# EAGLE design rxsms-2.0-Stromvers (EAGLE 6.6.0)

## Sheet 1 of 2
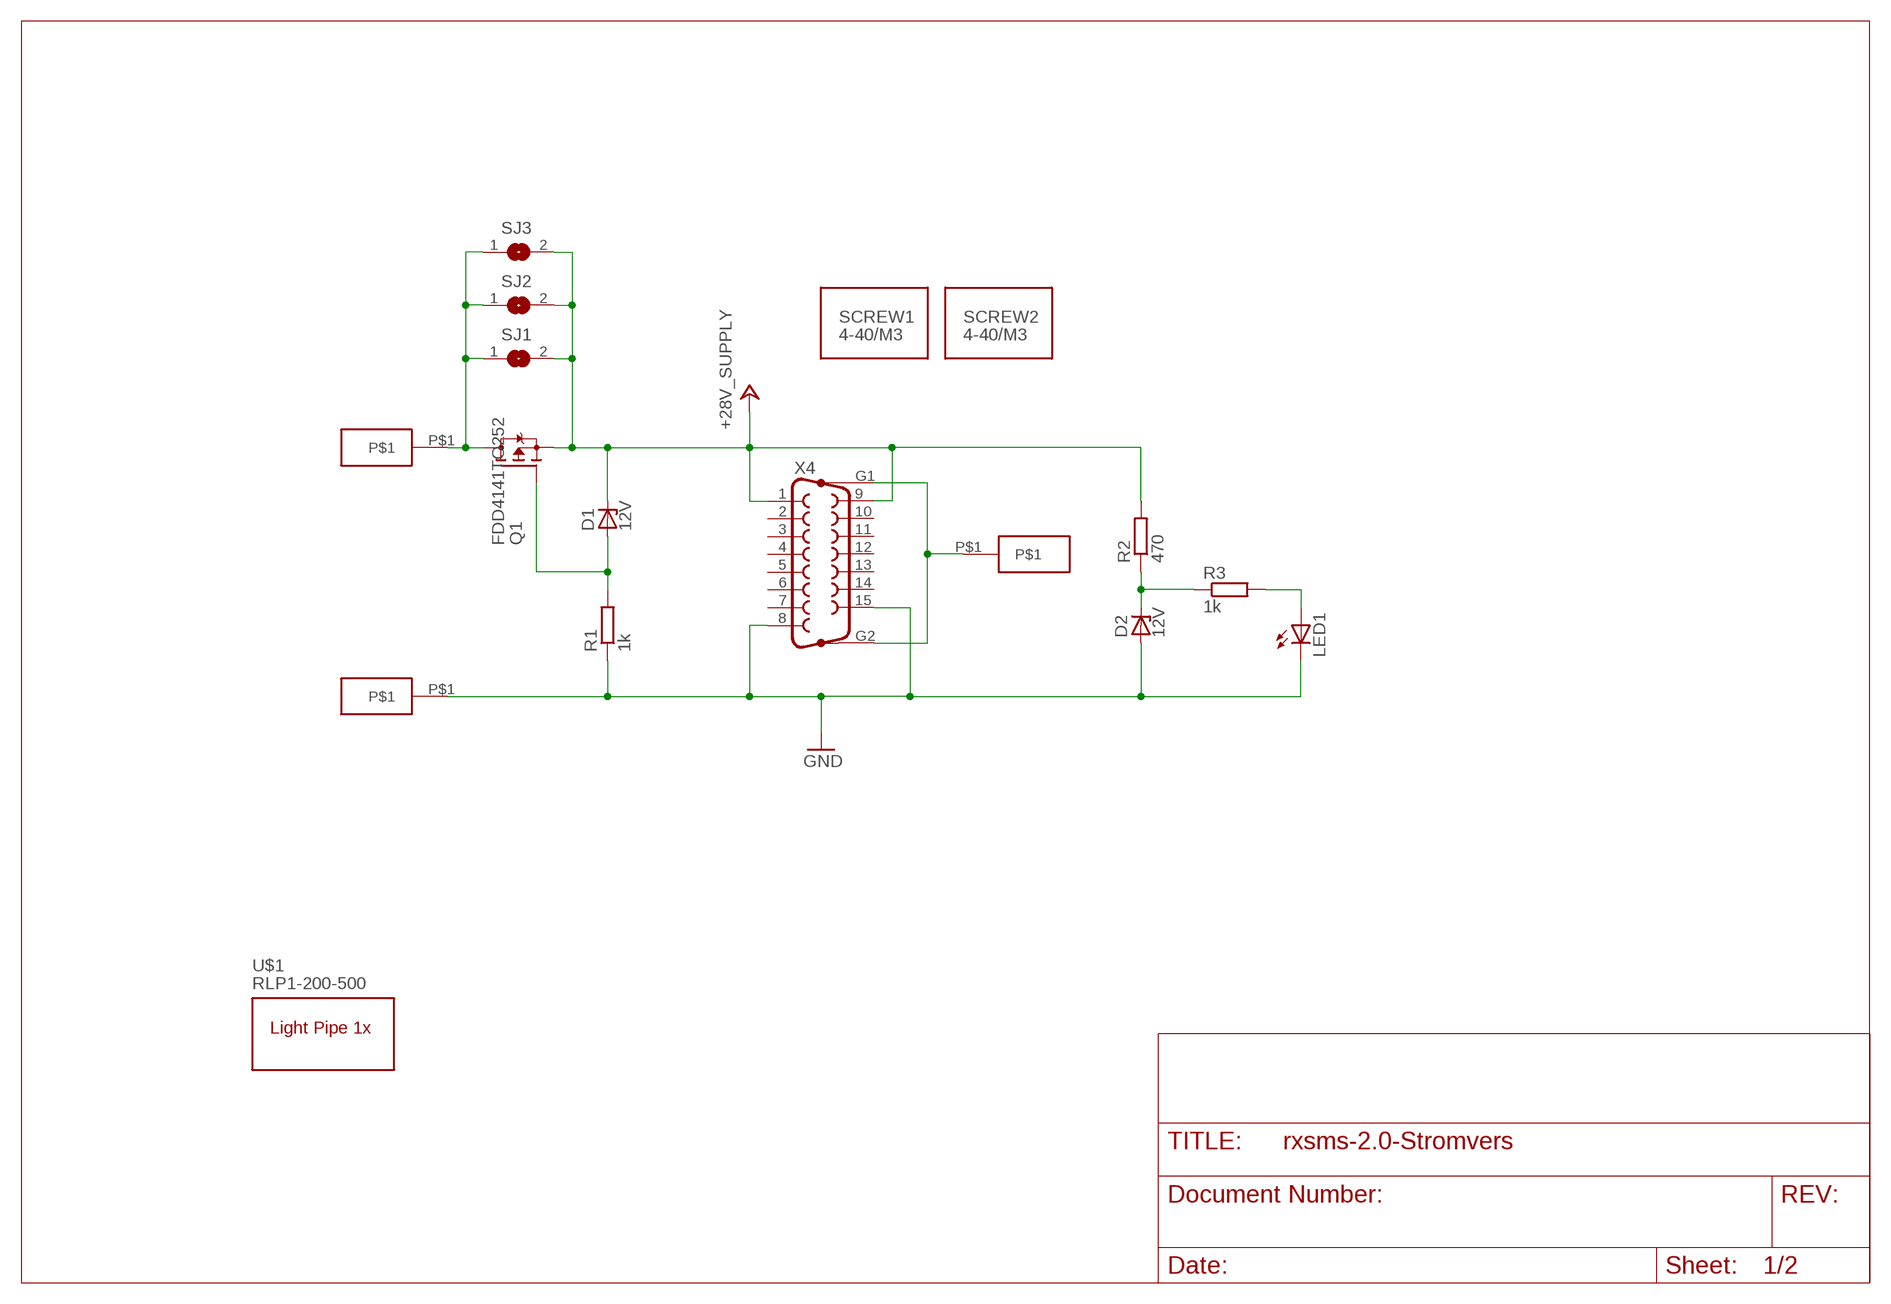
[diagram p0: schematic, sheet 1]

### Parts
D1  12V  ZENER-DIODEDO34-7  [DO34Z7]
D2  12V  ZENER-DIODEDO34-7  [DO34Z7]
LED1  LEDCHIPLED_0805  [CHIPLED_0805]
Q1  FDD4141TO252  [TO252]
R1  1k  R-EU_R0805  [R0805]
R2  470  R-EU_R0805  [R0805]
R3  1k  R-EU_R0805  [R0805]
SCREW1  4-40/M3  DSUB_MOUNTING_SCREW  [SCREW_DUMMY]
SCREW2  4-40/M3  DSUB_MOUNTING_SCREW  [SCREW_DUMMY]
SJ1  SJ  [SJ]
SJ2  SJ  [SJ]
SJ3  SJ  [SJ]
U$1  RLP1-200-500  [RLP1-200-500]
U$3  JACK  [JACK]
U$4  JACK  [JACK]
U$5  JACK  [JACK]
X4  F15HP  [F15HP]

### Nets
+28V_SUPPLY: D1.C Q1.2(S) R2.2 SJ1.2 SJ2.2 SJ3.2 X4.1 X4.9 ; also sheet 2
BLUB: Q1.3(D) SJ1.1 SJ2.1 SJ3.1 U$3.P$1
GND: D2.A LED1.C R1.1 U$4.P$1 X4.8 X4.15 ; also sheet 2
N$1: D2.C R2.1 R3.1
N$2: D1.A Q1.1(G) R1.2
N$3: LED1.A R3.2
PE: U$5.P$1 X4.G1 X4.G2
Unconnected: X4.2 X4.3 X4.4 X4.5 X4.6 X4.7 X4.10 X4.11 X4.12 X4.13 X4.14

## Sheet 2 of 2
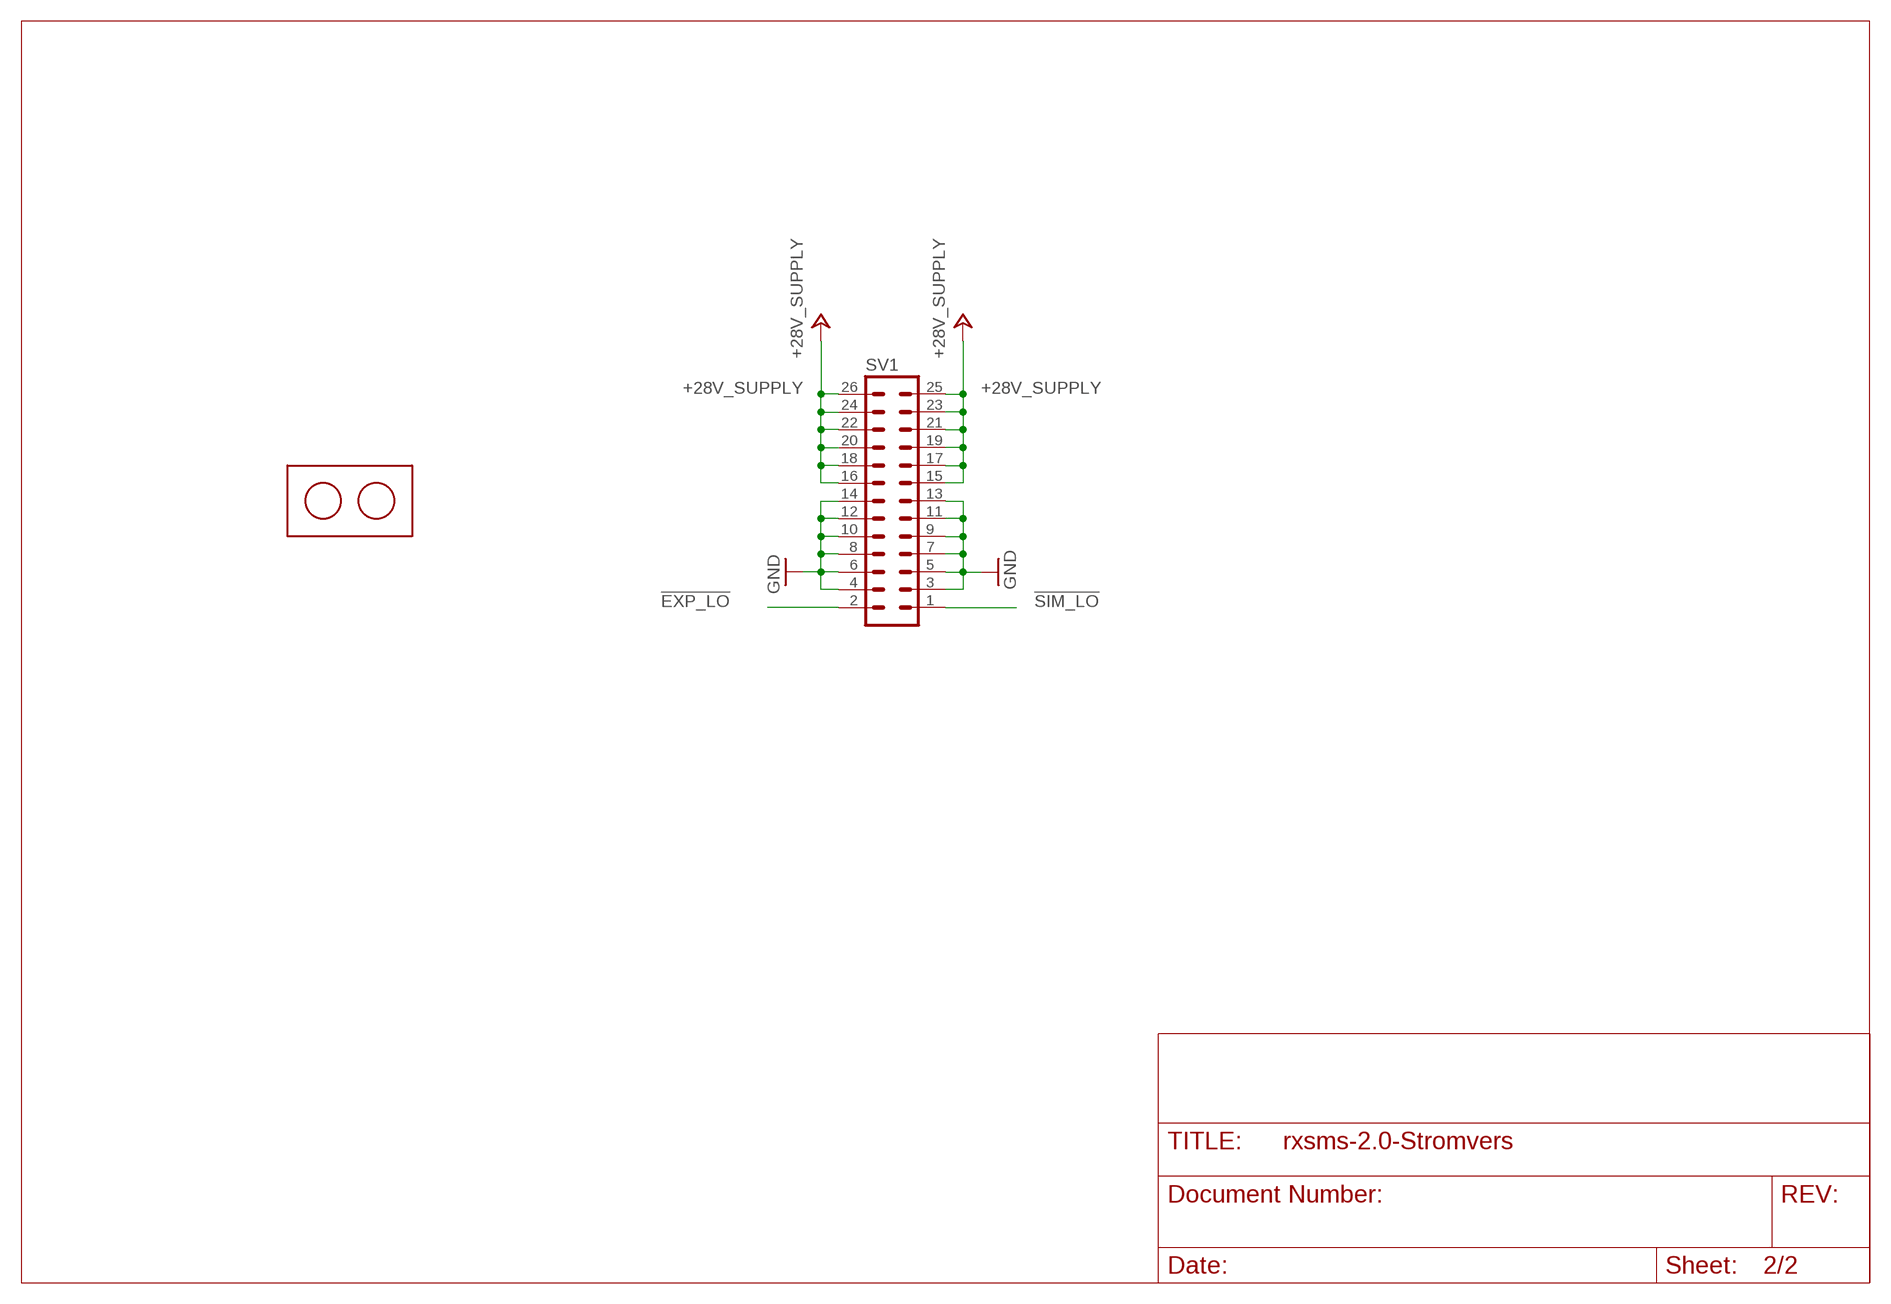
[diagram p1: schematic, sheet 2]

### Parts
SV1  ML26L  [ML26L]
U$6  BUERKLIN17H912  [BUERKLIN17H912]

### Nets
+28V_SUPPLY: SV1.15 SV1.16 SV1.17 SV1.18 SV1.19 SV1.20 SV1.21 SV1.22 SV1.23 SV1.24 SV1.25 SV1.26 ; also sheet 1
GND: SV1.3 SV1.4 SV1.5 SV1.6 SV1.7 SV1.8 SV1.9 SV1.10 SV1.11 SV1.12 SV1.13 SV1.14 ; also sheet 1
Unconnected: SV1.1 SV1.2

## Library data of the parts
D1 D2 = diode:ZENER-DIODE: Z-Diode; OC_FARNELL: 1779204
LED1 = led:LED: LED OSRAM: - CHIPLED LG R971, LG N971, LY N971, LG Q971, LY Q971, LO R971, LY R971 LH N974, LH R974 LS Q976, LO Q976, LY Q976 LO Q996 - Hyper CHIPLED LW Q18S LB Q993, LB Q99A, LB R99A - SideLED LS A670, LO A670, LY A670, LG A670, LP A670 LB A673, LV A673, LT A673, LW A673 LH A674 LY A675 LS A676, LA A676, LO A676, LY A676, LW A676 LS A679, LY A679, LG A679 - Hyper Micro SIDELED® LS Y876, LA Y876, LO Y876, LY Y876 LT Y87S - SmartLED LW L88C, LW L88S LB L89C, LB L89S, LG L890 LS L89K, LO L89K, LY L89K LS L896, LA L896, LO L896, LY L896 - TOPLED LS T670, LO T670, LY T670, LG T670, LP T670 LSG T670, LSP T670, LSY T670, LOP T670, LYG T670 LG T671, LOG T671, LSG T671 LB T673, LV T673, LT T673, LW T673 LH T674 LS T676, LA T676, LO T676, LY T676, LB T676, LH T676, LSB T676, LW T676 LB T67C, LV T67C, LT T67C, LS T67K, LO T67K, LY T67K, LW E67C LS E67B, LA E67B, LO E67B, LY E67B, LB E67C, LV E67C, LT E67C LW T67C LS T679, LY T679, LG T679 LS T770, LO T770, LY T770, LG T770, LP T770 LB T773, LV T773, LT T773, LW T773 LH T774 LS E675, LA E675, LY E675, LS T675 LS T776, LA T776, LO T776, LY T776, LB T776 LHGB T686 LT T68C, LB T68C - Hyper Mini TOPLED® LB M676 - Mini TOPLED Santana® LG M470 LS M47K, LO M47K, LY M47K Source: http://www.osram.convergy.de LUXEON: - LUMILED® LXK2-PW12-R00, LXK2-PW12-S00, LXK2-PW14-U00, LXK2-PW14-V00 LXK2-PM12-R00, LXK2-PM12-S00, LXK2-PM14-U00 LXK2-PE12-Q00, LXK2-PE12-R00, LXK2-PE12-S00, LXK2-PE14-T00, LXK2-PE14-U00 LXK2-PB12-K00, LXK2-PB12-L00, LXK2-PB12-M00, LXK2-PB14-N00, LXK2-PB14-P00, LXK2-PB14-Q00 LXK2-PR12-L00, LXK2-PR12-M00, LXK2-PR14-Q00, LXK2-PR14-R00 LXK2-PD12-Q00, LXK2-PD12-R00, LXK2-PD12-S00 LXK2-PH12-R00, LXK2-PH12-S00 LXK2-PL12-P00, LXK2-PL12-Q00, LXK2-PL12-R00 Source: www.luxeon.com KINGBRIGHT: KA-3528ASYC Source: www.kingbright.com; OC_RS: 692-0957
Q1 = transistor-fet:FDD4141: P-Channel PowerTrench® MOSFET Source: FDD4141.pdf; OC_FARNELL: 2101406
R1-R3 = rcl:R-EU_: RESISTOR, European symbol
SCREW1 SCREW2 = dsub-mounting-screw:DSUB_MOUNTING_SCREW; OC_FARNELL: 2135988
SJ1-SJ3 = jumper:SJ: SMD solder JUMPER
SV1 = con-harting-ml:ML26: HARTING; OC_FARNELL: 1096983 (Gegenstück: 1200506 oder 1097038); OC_NEWARK: unknown
U$1 = light-pipe:RLP1-200-500; OC_FARNELL: 1887972; OC_RS: 752-9141
U$3-U$5 = jack:JACK; OC_FARNELL: 1854507 (black), 1854508 (red), 1854511 (blue), 1854510 (yellow)
U$6 = jack:BUERKLIN17H912; OC_BUERKLIN: 17H912
X4 = con-subd:F15HP: SUB-D; OC_FARNELL: 1207598; OC_NEWARK: unknown

## Board
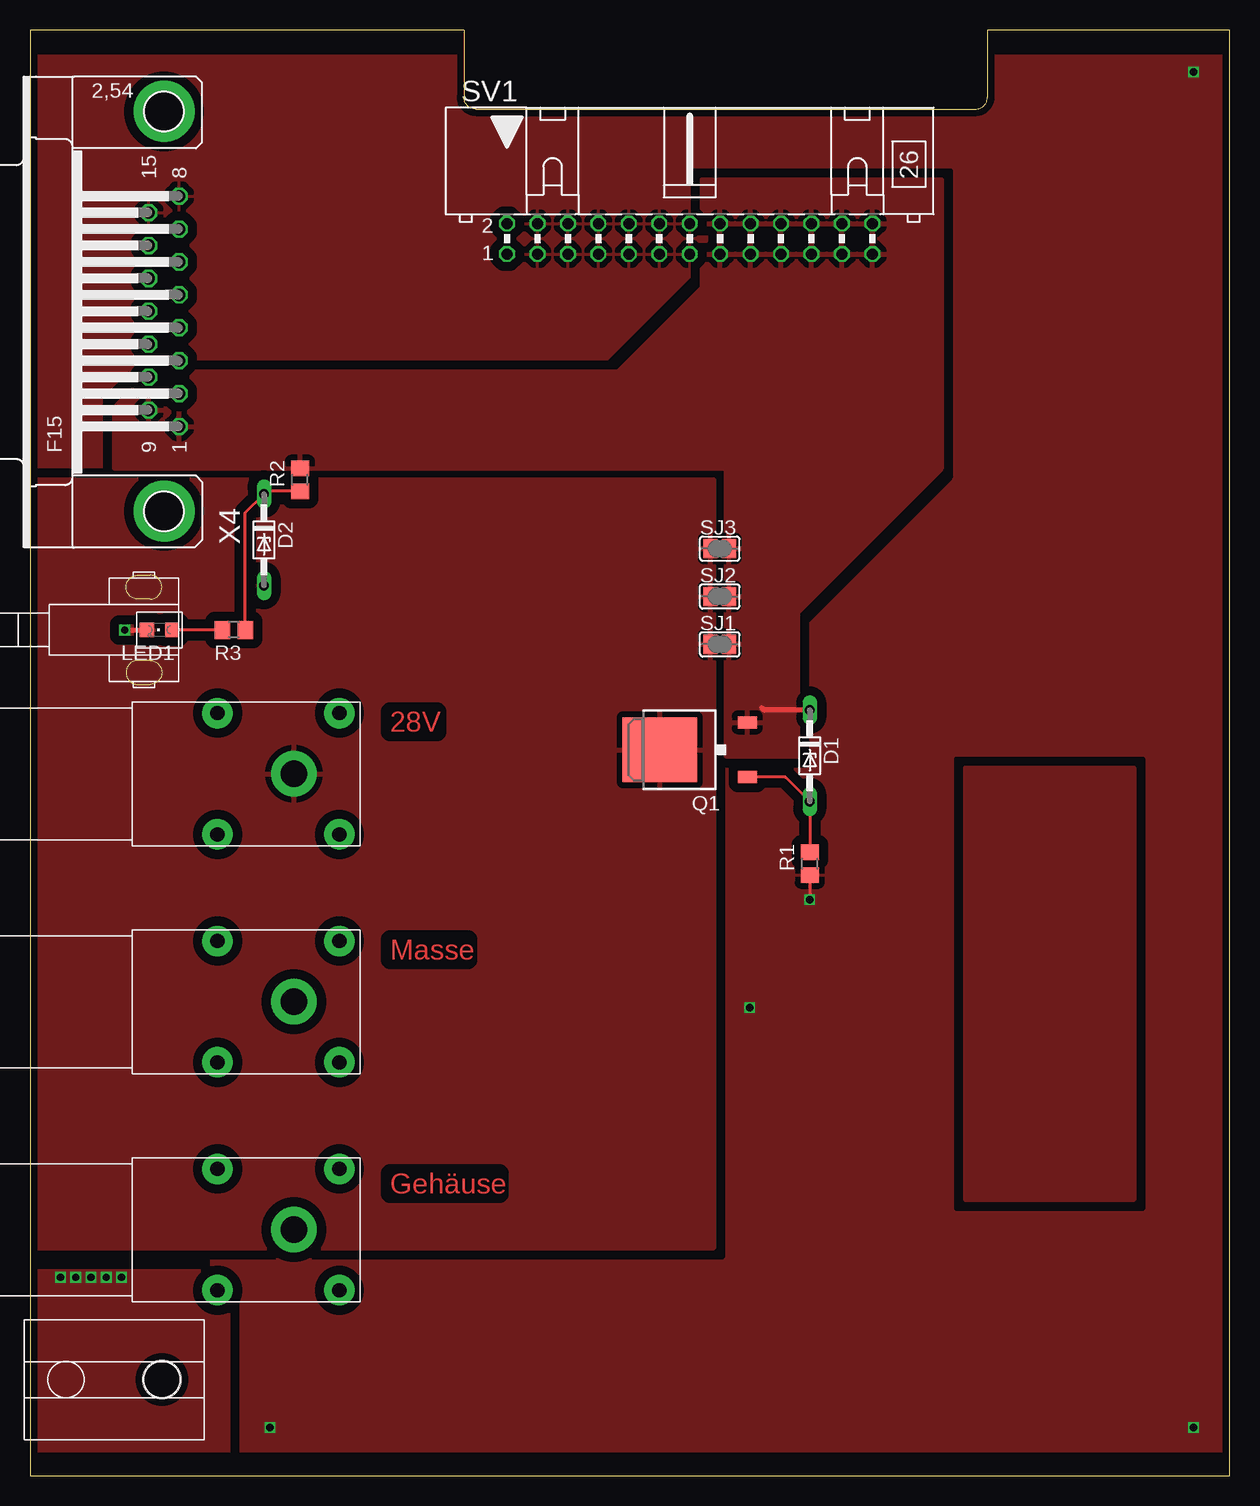
[diagram p2: board, top side]
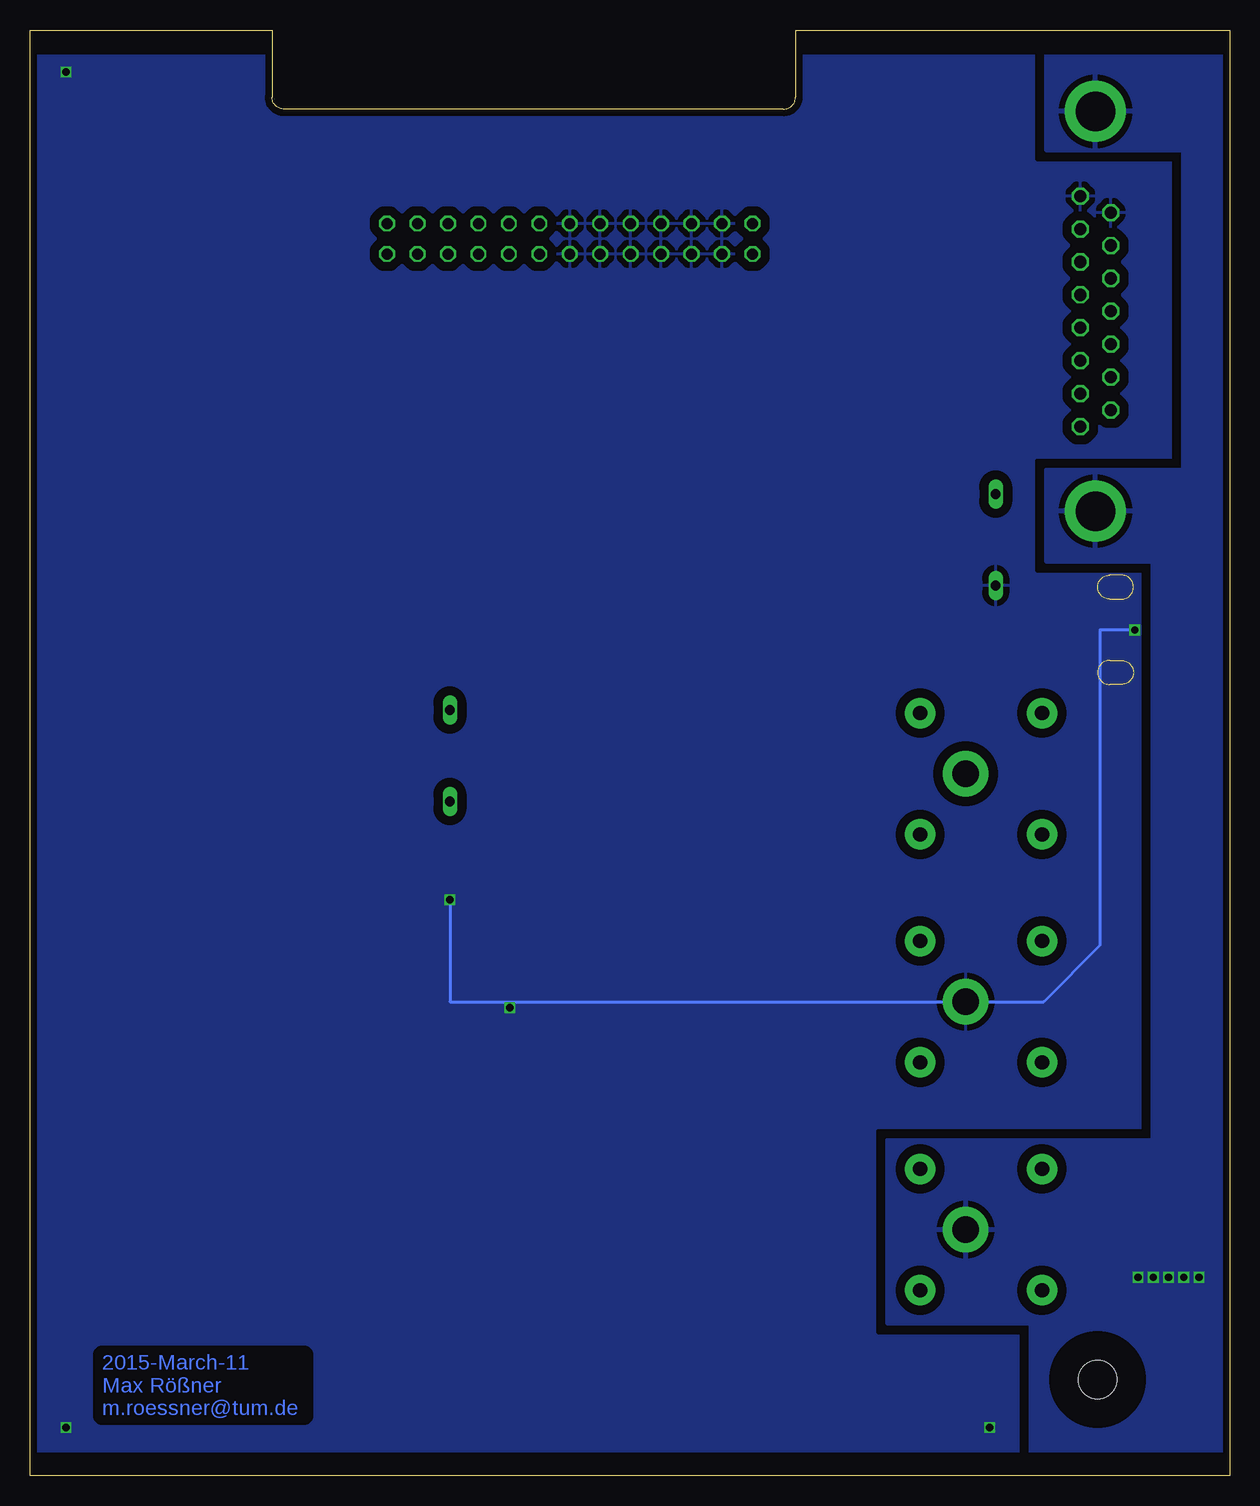
[diagram p3: board, bottom side, seen from below]

Size 100 x 120.5 mm. Coordinates in mm from the lower left corner, seen from the top.
Outline: 0,0 100,0 100,120.5 79.82,120.5 79.82,114.9 arc-90 78.82,113.9 37.18,113.9 arc-90 36.18,114.9 36.18,120.5 0,120.5 0,0
Copper layers (1*16): Top 0.035mm / dielectric 1.5mm / Bottom 0.035mm
Design rules "multi-cb_035um-cu *": minimum track width 6mil, minimum drill 12mil, track to track 30mil, track to pad 6mil, pad to pad 6mil, via to via 6mil, smd to smd 6mil, copper to edge 23mil, drill to drill 8mil, minimum pad ring 8mil, minimum via ring 6mil, stop-mask expansion 3mil, vias tented up to drill 0mil, thermal gap 20mil
tRestrict: area 0,118.5 to 100,120.5; area 0,0 to 100,1.9
bRestrict: area 0,0 to 100,1.9; area 0,118.5 to 100,120.5; area 7.1,4.1 to 14.9,11.9

### Footprints (pad centres in the part's own frame; a part is rotated, then mirrored left to right if it is on the bottom)
DO34Z7 = drill 0.813 long: A 3.81,0; C -3.81,0
CHIPLED_0805 = smd 1.2 x 1.2: A 0,-1.05; C 0,1.05
TO252 = smd 1 x 1.6: 1 -2.28,-4.8; 2 2.28,-4.8 | smd 5.4 x 6.2: 3 0,2.5
R0805 = smd 1.3 x 1.5: 1 -0.95,0; 2 0.95,0
SJ = smd 1.168 x 1.6: 1 -0.762,0; 2 0.762,0
ML26L = drill 0.914 octagon: 1 -15.24,-1.27; 2 -15.24,1.27; 3 -12.7,-1.27; 4 -12.7,1.27; 5 -10.16,-1.27; 6 -10.16,1.27; 7 -7.62,-1.27; 8 -7.62,1.27; 9 -5.08,-1.27; 10 -5.08,1.27; 11 -2.54,-1.27; 12 -2.54,1.27; 13 0,-1.27; 14 0,1.27; 15 2.54,-1.27; 16 2.54,1.27; 17 5.08,-1.27; 18 5.08,1.27; 19 7.62,-1.27; 20 7.62,1.27; 21 10.16,-1.27; 22 10.16,1.27; 23 12.7,-1.27; 24 12.7,1.27; 25 15.24,-1.27; 26 15.24,1.27
JACK = drill 1.2 pad 2.54: NC1 -6.36,5.06; NC2 3.8,5.06; NC3 -6.36,-5.06; NC4 3.8,-5.06 | drill 2.2 pad 3.81: P$1 0,0
BUERKLIN17H912 = hole 3.2: 0,0
F15HP = drill 1.016 octagon: 1 -9.601,-1.27; 2 -6.858,-1.27; 3 -4.115,-1.27; 4 -1.372,-1.27; 5 1.372,-1.27; 6 4.115,-1.27; 7 6.858,-1.27; 8 9.601,-1.27; 9 -8.23,1.27; 10 -5.486,1.27; 11 -2.743,1.27; 12 0,1.27; 13 2.743,1.27; 14 5.486,1.27; 15 8.23,1.27 | drill 3.302 pad 5.08: G1 -16.662,0; G2 16.662,0

### Placement (x,y rotation side)
D1  65,60 270 top
D2  19.5,78 270 top
LED1  10.8,70.5 90 top
Q1  55,60.5 90 top
R1  65,51 90 top
R2  22.5,83 90 top
R3  17,70.5 180 top
SCREW1  -7.43,80 0 top  (outside the outline)
SCREW2  -7.09,114 0 top  (outside the outline)
SJ1  57.5,69.3 0 top
SJ2  57.5,73.28 0 top
SJ3  57.5,77.27 0 top
SV1  55,103.1 0 top
U$1  10.8,70.5 270 top
U$3  22,58.5 0 top
U$4  22,39.5 0 top
U$5  22,20.5 0 top
U$6  11,8 0 top
X4  11.17,97.05 90 top

### Tracks (layer width: path | path; a pad name or v marks a point on that pad's centre or on a via)
+28V_SUPPLY
  Top 0.406: D1.C 61.19,63.81 61,64
  pour Top: 7,89 7,84 58,84 58,60 64,60 64,72 76,84 76,108 56,108 56,99 49,92 10,92
BLUB
  pour Top: -1,83 -1,19 57,19 57,83
GND  (via drill 0.6)
  Top 0.254: R1.1 v65,48
  Top 0.406: v7.89,70.48 9.75,70.48 LED1.C
  Bottom 0.254: v65,48 65,39.5 U$4.P$1 15.5,39.5 10.79,44.2 10.79,70.48 v7.89,70.48
  other vias: 60,39 20,4 97,4 97,117
  pour Bottom (rank 2): -1,122 102,122 102,-2 -1,-2
  pour Top (rank 2): -2,123 102,123 102,-2 -2,-2
N$1
  Top 0.254: R3.1 17.95,80.26 D2.C 19.74,82.05 R2.1
N$2
  Top 0.254: Q1.1 62.97,58.22 D1.A R1.2
N$3
  Top 0.254: R3.2 LED1.A
N$4
  pour Top: 78,59 92,59 92,23 78,23
PE  (via drill 0.6)
  other vias: 2.54,16.51 3.81,16.51 5.08,16.51 6.35,16.51 7.62,16.51
  pour Bottom: 16.51,12.7 28.48,12.7 28.48,27.94 6.35,27.94 6.35,76.2 15.24,76.2 15.24,83.82 3.81,83.82 3.81,110.49 15.24,110.49 15.24,121.92 -8.89,121.92 -8.89,-1.27 16.51,-1.27
  pour Top: 16.51,-1.27 16.51,17 -5.08,17 -5.08,-1.27

### Text on the board
Top: 28V | Masse | Gehäuse
Bottom: 2015-March-11 / Max Rößner / m.roessner@tum.de